# EAGLE design Breadboard_ICSP (EAGLE 6.5.0)
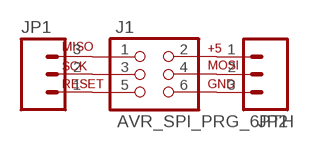
[diagram p0: schematic, sheet 1]

## Parts
J1  AVR_SPI_PRG_6PTH  [2X3]
JP1  M03PTH  [1X03]
JP2  M03PTH  [1X03]

## Nets
N$1: J1.5 JP1.1
N$2: J1.3 JP1.2
N$3: J1.1 JP1.3
N$4: J1.2 JP2.1
N$5: J1.4 JP2.2
N$6: J1.6 JP2.3

## Library data of the parts
J1 = barbary_enterprises:AVR_SPI_PRG_6: AVR ISP 6 Pin This is the reduced ISP connector for AVR programming. Common on Arduino. This footprint will take up less PCB space and can be used with a 10-pin to 6-pin adapter such as SKU: BOB-08508
JP1 JP2 = SparkFun-Connectors:M03: Header 3 Standard 3-pin 0.1" header. Use with straight break away headers (SKU : PRT-00116), right angle break away headers (PRT-00553), swiss pins (PRT-00743), machine pins (PRT-00117), and female headers (PRT-00115). Molex polarized connector foot print use with SKU : PRT-08232 with associated crimp pins and housings.

## Board
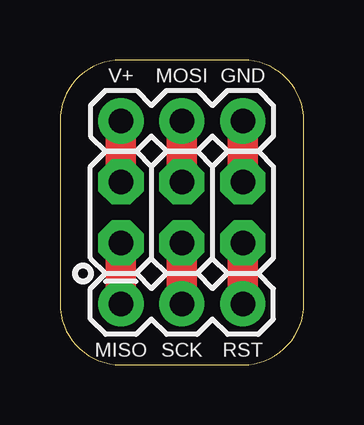
[diagram p1: board, top side]

Size 10.16 x 12.7 mm. Coordinates in mm from the lower left corner, seen from the top.
Outline: 0,10.16 0,2.54 arc90 2.54,0 7.62,0 arc90 10.16,2.54 10.16,10.16 arc90 7.62,12.7 2.54,12.7 arc90 0,10.16
Copper layers (1*16): Top 0.035mm / dielectric 1.5mm / Bottom 0.035mm
Design rules "default": minimum track width 10mil, minimum drill 24mil, track to track 8mil, track to pad 8mil, pad to pad 8mil, via to via 8mil, smd to smd 8mil, copper to edge 40mil, drill to drill 8mil, minimum pad ring 10mil, minimum via ring 8mil, stop-mask expansion 4mil, vias tented up to drill 0mil, thermal gap 10mil

### Footprints (pad centres in the part's own frame; a part is rotated, then mirrored left to right if it is on the bottom)
2X3 = drill 1.016 pad 1.88 octagon: 1 0,0; 2 0,2.54; 3 2.54,0; 4 2.54,2.54; 5 5.08,0; 6 5.08,2.54
1X03 = drill 1.016 pad 1.88: 1 0,0; 2 2.54,0; 3 5.08,0

### Placement (x,y rotation side)
J1  2.54,5.08 0 top
JP1  7.62,2.54 180 top
JP2  2.54,10.16 0 top

### Tracks (layer width: path | path; a pad name or v marks a point on that pad's centre or on a via)
N$1
  Top 1.27: J1.5 JP1.1
N$2
  Top 1.27: J1.3 JP1.2
N$3
  Top 1.27: J1.1 JP1.3
N$4
  Top 1.27: JP2.1 J1.2
N$5
  Top 1.27: JP2.2 J1.4
N$6
  Top 1.27: JP2.3 J1.6

### Text on the board
tPlace: V+ | MOSI | GND | MISO | SCK | RST